# EAGLE design coil_havester_board (EAGLE 9.5.1)
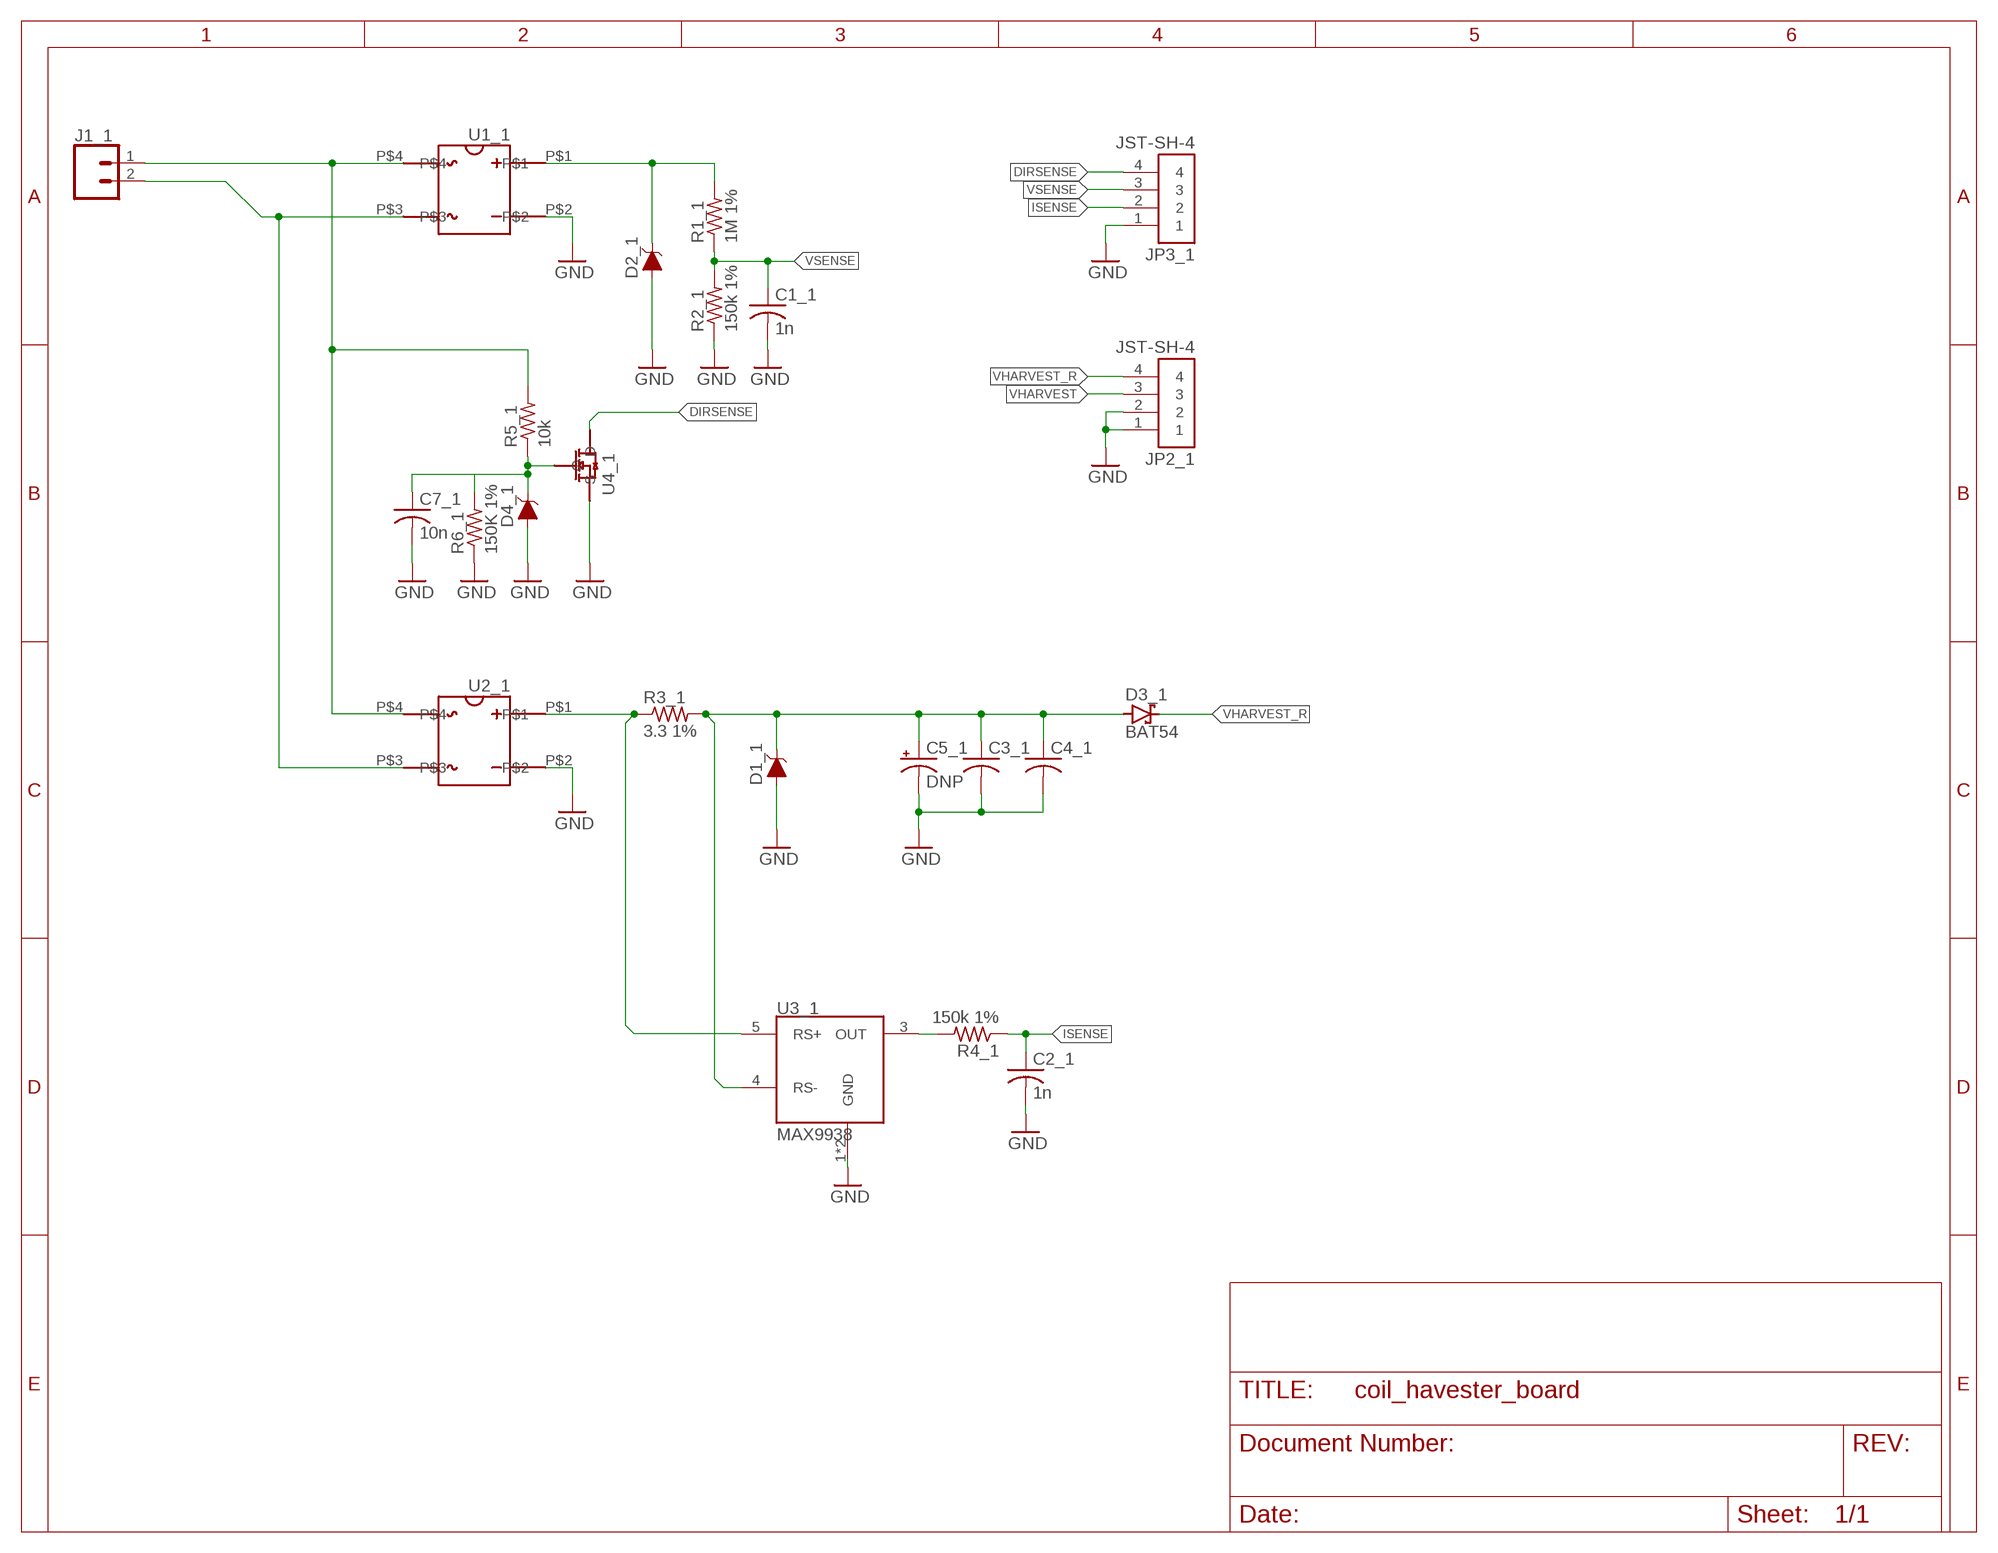
[diagram p0: schematic, sheet 1]

## Parts
C1_1  1n  C-USC0402  [C0402]
C2_1  1n  C-USC0402  [C0402]
C3_1  C-USC1206  [C1206]
C4_1  C-USC1206  [C1206]
C5_1  DNP  CPOL-USE2.5-5  [E2,5-5]
C7_1  10n  C-USC0402  [C0402]
D1_1  3.3V  DIODE-ZENER-MM3Z3V3T1G  [SOD-323]
D2_1  3.3V  DIODE-ZENER-MM3Z3V3T1G  [SOD-323]
D3_1  BAT54  [SOT23]
D4_1  3.3V  DIODE-ZENER-MM3Z3V3T1G  [SOD-323]
J1_1  CONN_02-JST-2MM-SMT  [JST-2-SMD]
JP2_1  JST-SH-4  [JST-SH-4]
JP3_1  JST-SH-4  [JST-SH-4]
R1_1  1M 1%  R-US_R0402  [R0402]
R2_1  150k 1%  R-US_R0402  [R0402]
R3_1  3.3 1%  R-US_R0603  [R0603]
R4_1  150k 1%  R-US_R0402  [R0402]
R5_1  10k  R-US_R0402  [R0402]
R6_1  150K 1%  R-US_R0402  [R0402]
U1_1  CDBHD140L-G  [CDBHDXX0L-G]
U2_1  CDBHD140L-G  [CDBHDXX0L-G]
U3_1  MAX9938  [SOT23-5]
U4_1  TN2106K1-G  [TN2106K1-G]

## Nets
DIRSENSE: JP3_1.4 U4_1.D
GND: C1_1.2 C2_1.2 C3_1.2 C4_1.2 C5_1.- C7_1.2 D1_1.A D2_1.A D4_1.A JP2_1.1 JP2_1.2 JP3_1.1 R2_1.1 R6_1.1 U1_1.P$2 U2_1.P$2 U3_1.1(GND) U3_1.2(GND) U4_1.S
ISENSE: C2_1.1 JP3_1.2 R4_1.1
N$1: J1_1.1 R5_1.2 U1_1.P$4 U2_1.P$4
N$2: J1_1.2 U1_1.P$3 U2_1.P$3
N$3: D2_1.C R1_1.2 U1_1.P$1
N$4: R3_1.1 U2_1.P$1 U3_1.5(RS+)
N$6: R4_1.2 U3_1.3(OUT)
N$7: C7_1.1 D4_1.C R5_1.1 R6_1.2 U4_1.G
VHARVEST: C3_1.1 C4_1.1 C5_1.+ D1_1.C D3_1.1(A) JP2_1.3 R3_1.2 U3_1.4(RS-)
VHARVEST_R: D3_1.3(C) JP2_1.4
VSENSE: C1_1.1 JP3_1.3 R1_1.1 R2_1.2

## Library data of the parts
C1_1 C2_1 = rcl:C-US: CAPACITOR, American symbol; MFR: SAMSUNG; MFR_PN: CL05B102KB5NNNC; SPICEPREFIX: C
C3_1 C4_1 = rcl:C-US: CAPACITOR, American symbol; MFR: TDK; MFR_PN: C3216X5R1E476M160AC; SPICEPREFIX: C
C5_1 = rcl:CPOL-US: POLARIZED CAPACITOR, American symbol; SPICEPREFIX: C
C7_1 = rcl:C-US: CAPACITOR, American symbol; MFR: SAMSUNG; MFR_PN: CL05B103KB5NNNC; SPICEPREFIX: C
D1_1 D2_1 = SparkFun-DiscreteSemi:DIODE-ZENER: Zener Diode A Zener diode allows current to flow from its anode to its cathode like a normal semiconductor diode, but it also permits current to flow in the reverse direction when its "Zener voltage" is reached. - WIkipedia; MFR: DIODES_INCORPORATED; MFR_PN: BZT52C15S; PROD_ID: DIO-11284
D3_1 = diode:BAT54: Schottky Diodes Source: Fairchild .. BAT54.pdf; MFR: ON; MFR_PN: BAT54
D4_1 = SparkFun-DiscreteSemi:DIODE-ZENER: Zener Diode A Zener diode allows current to flow from its anode to its cathode like a normal semiconductor diode, but it also permits current to flow in the reverse direction when its "Zener voltage" is reached. - WIkipedia; PROD_ID: DIO-11284
J1_1 = SparkFun-Connectors:CONN_02: Multi connection point. Often used as Generic Header-pin footprint for 0.1 inch spaced/style header connections On any of the 0.1 inch spaced packages, you can populate with these: Break Away Headers - Straight <https://www.sparkfun.com/products/116> (PRT-00116) Break Away Male Headers - Right Angle <https://www.sparkfun.com/products/553> (PRT-00553) Female Headers <https://www.sparkfun.com/products/115> (PRT-00115) Break Away Headers - Machine Pin <https://www.sparkfun.com/products/117> (PRT-00117) Break Away Female Headers - Swiss Machine Pin <https://www.sparkfun.com/products/743> (PRT-00743) For SCREWTERMINALS and SPRING TERMINALS visit here: Screw Terimnals on SparkFun.com <https://www.sparkfun.com/search/results?term=Screw+Terminals> (5mm/3.5mm/2.54mm spacing) This device is also useful as a general connection point to wire up your design to another part of your project. Our various solder wires solder well into these plated through hole pads. Hook-Up Wire - Assortment (Stranded, 22 AWG) <https://www.sparkfun.com/products/11375> (PRT-11375) Hook-Up Wire - Assortment (Solid Core, 22 AWG) <https://www.sparkfun.com/products/11367> (PRT-11367) View the entire wire category on our website here <https://www.sparkfun.com/categories/141> Special notes: Molex polarized connector foot print use with: PRT-08233 with associated crimp pins and housings. 2.54_SCREWTERM for use with PRT-10571. 3.5mm Screw Terminal footprints for PRT-08084 5mm Screw Terminal footprints for use with PRT-08432; MFR: JST; MFR_PN: S2B-PH-SM4-TB(LF)(SN); PROD_ID: CONN-11443
JP2_1 JP3_1 = jst-sh:JST-SH-4: JST-SH 4 pin connector; MFR: JST; MFR_PN: SM04B-SRSS-TB(LF)(SN)
R1_1 = rcl:R-US_: RESISTOR, American symbol; MFR: YAGEO; MFR_PN: RC0402FR-071ML; SPICEPREFIX: R
R2_1 R4_1 R6_1 = rcl:R-US_: RESISTOR, American symbol; MFR: YAGEO; MFR_PN: RC0402FR-07150KL; SPICEPREFIX: R
R3_1 = rcl:R-US_: RESISTOR, American symbol; MFR: PANASONIC; MFR_PN: ERJ-3BQF3R3V; SPICEPREFIX: R
R5_1 = rcl:R-US_: RESISTOR, American symbol; MFR: YAGEO; MFR_PN: RC0402FR-0710KL; SPICEPREFIX: R
U1_1 U2_1 = afig-0007:CDBHD140L-G; MFR: COMCHIP; MFR_PN: CDBHD140L-G
U3_1 = max9938:MAX9938: 1μA, 4-Bump UCSP/SOT23, Precision Current-Sense Amplifier The MAX9938 high-side current-sense amplifier offers precision accuracy specifications of VOS less than 500μV (max) and gain error less than 0.5% (max). Quiescent supply current is an ultra-low 1μA. The MAX9938 fits in a tiny, 1mm x 1mm UCSPTM package size or a 5-pin SOT23 package, making the part ideal for applications in notebook computers, cell phones, PDAs, and all battery-operated portable devices where accura- cy, low quiescent current, and small size are critical. The MAX9938 features an input common-mode voltage range from 1.6V to 28V. These current-sense amplifiers have a voltage output and are offered in four gain versions: 25V/V (MAX9938T), 50V/V (MAX9938F), 100V/V (MAX9938H), and 200V/V (MAX9938W). The four gain selections offer flexibility in the choice of the external current-sense resistor. The very low 500μV (max) input offset voltage allows small 25mV to 50mV full-scale VSENSE voltage for very low voltage drop at full-current measurement. The MAX9938 is offered in tiny 4-bump, UCSP (1mm x 1mm x 0.6mm footprint), 5-pin SOT23, and 6-pin μDFN (2mm x 2mm x 0.8mm) packages specified for operation over the -40°C to +85°C extended temperature range.; MFR: MAXIM; MFR_PN: MAX9938TEUK+T
U4_1 = tn2106:TN2106K1-G: N-Channel Enhancement-Mode Vertical DMOS FET R_dson(max) = 2.5Ohm V_gs(th)(max) = 2V; MFR: MICROCHIP; MFR_PN: TN2106K1-G

## Board
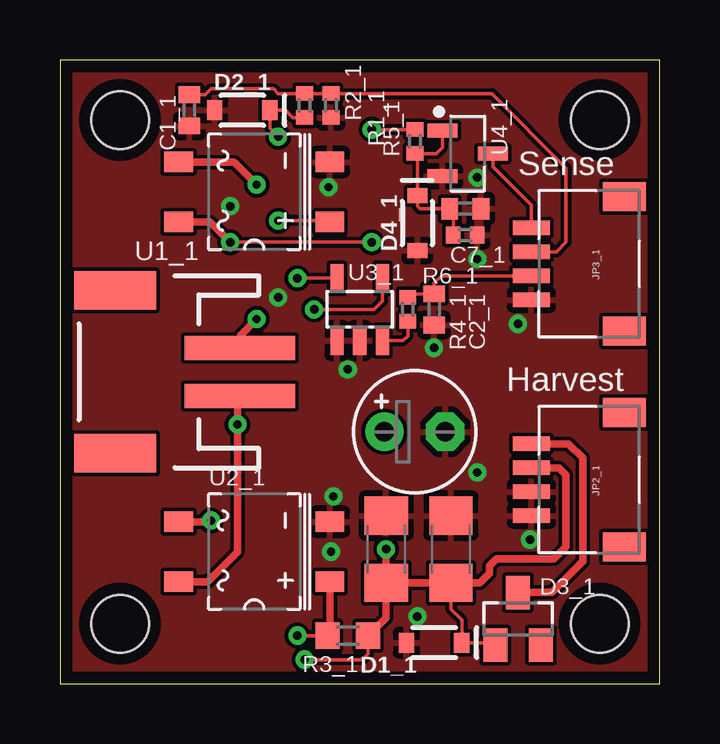
[diagram p1: board, top side]
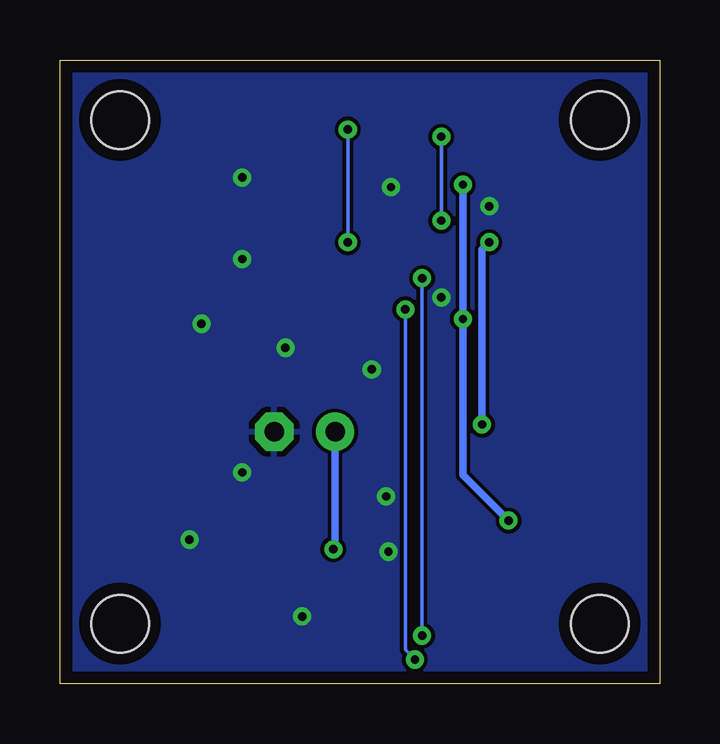
[diagram p2: board, bottom side, seen from below]

Size 25 x 26 mm. Coordinates in mm from the lower left corner, seen from the top.
Outline: 0,0 25,0 25,26 0,26 0,0
Copper layers (1*16): Top 0.035mm / dielectric 1.5mm / Bottom 0.035mm
Design rules "default *": minimum track width 6mil, minimum drill 0.35mm, track to track 6mil, track to pad 6mil, pad to pad 6mil, via to via 6mil, smd to smd 6mil, copper to edge 20mil, drill to drill 6mil, minimum pad ring 10mil, minimum via ring 8mil, stop-mask expansion 4mil, vias tented up to drill 0.35mm, thermal gap 10mil
Holes 2.4 mm at 2.5,23.5 2.5,2.5 22.5,2.5 22.5,23.5

### Footprints (pad centres in the part's own frame; a part is rotated, then mirrored left to right if it is on the bottom)
C0402 = smd 0.7 x 0.9: 1 -0.65,0; 2 0.65,0
C1206 = smd 1.6 x 1.8: 1 -1.4,0; 2 1.4,0
E2,5-5 = drill 0.813 pad 1.6: + -1.27,0 | drill 0.813 pad 1.6 octagon: - 1.27,0
SOD-323 = smd 0.63 x 0.83: A 1.15,0; C -1.15,0
SOT23 = smd 1 x 1.4: 1 -0.95,-1.1; 2 0.95,-1.1; 3 0,1.1
JST-2-SMD = smd 1 x 4.6: 1 -1,-3.7; 2 1,-3.7 | smd 1.6 x 3.4: NC1 -3.4,1.5; NC2 3.4,1.5
JST-SH-4 = smd 0.6 x 1.55: 1 -1.5,2.34; 2 -0.5,2.34; 3 0.5,2.34; 4 1.5,2.34 | smd 1.2 x 1.8: P-MOUNT1 -2.8,-1.535; P-MOUNT2 2.8,-1.535
R0402 = smd 0.6 x 0.7: 1 -0.5,0; 2 0.5,0
R0603 = smd 1 x 1.1: 1 -0.85,0; 2 0.85,0
CDBHDXX0L-G = smd 0.85 x 1.2: P$1 1.25,3.15; P$2 -1.25,3.15; P$3 -1.25,-3.15; P$4 1.25,-3.15
SOT23-5 = smd 0.55 x 1.2: 1 -0.95,-1.3; 2 0,-1.3; 3 0.95,-1.3; 4 0.95,1.3; 5 -0.95,1.3
TN2106K1-G = smd 1.24 x 0.589: D 1.056,0; G -1.056,0.95; S -1.056,-0.95

### Placement (x,y rotation side)
C1_1  5.4,23.9 270 top
C2_1  15.6,15.6 270 top
C3_1  13.6,5.6 90 top
C4_1  16.3,5.6 90 top
C5_1  14.8,10.5 0 top
C7_1  16.9,19.8 0 top
D1_1  15.6,1.7 180 top
D2_1  7.6,23.9 180 top
D3_1  19.1,2.7 0 top
D4_1  14.9,19.2 270 top
J1_1  3.8,13 90 top
JP2_1  22,8.5 90 top
JP3_1  22,17.5 90 top
R1_1  10.2,24.1 270 top
R2_1  11.3,24.1 90 top
R3_1  12,2 0 top
R4_1  14.5,15.6 270 top
R5_1  14.8,22.6 90 top
R6_1  16.9,18.7 180 top
U1_1  8.1,20.5 270 top
U2_1  8.1,5.5 270 top
U3_1  12.5,15.6 0 top
U4_1  17,22.1 0 top

### Tracks (layer width: path | path; a pad name or v marks a point on that pad's centre or on a via)
DIRSENSE
  Top 0.152: U4_1.D 18.06,21.54 19.66,19.94 JP3_1.4
GND  (via drill 0.35)
  other vias: 11.4,7.8 12,13.1 15.6,14 19.1,15 17.4,8.8 19.6,6 17.4,21.1 11.2,20.7 11.3,5.5 17.4,17.7 14.9,2.8 7.1,19.9 9.1,16.1
  pour Top: -1,27 26,27 26,-1 -1,-1
  pour Bottom: 26,27 -1,27 -1,-1 26,-1
ISENSE
  Top 0.152: R4_1.1 14.65,16.25 C2_1.1 15.6,16.7 15.9,17 JP3_1.2
N$1  (via drill 0.35)
  Top 0.152: R5_1.2 v13,23.1 | v7.1,18.4 v13,18.4
  Top 0.305: U2_1.P$4 6.15,4.25 7.4,5.5 v7.4,10.8 7.4,12 J1_1.1 | U1_1.P$4 6.25,19.25 v7.1,18.4
  Bottom 0.152: v13,18.4 v13,23.1
  Bottom 0.305: v7.1,18.4 7.4,18.1 v7.4,10.8
N$2  (via drill 0.35)
  Top 0.305: U1_1.P$3 7.25,21.75 v8.2,20.8 | U2_1.P$3 6.25,6.75 v6.3,6.8 | J1_1.2 7.5,14.5 v8.2,15.2
  Bottom 0.305: v6.3,6.8 8.2,8.7 v8.2,15.2 v8.2,20.8
N$3  (via drill 0.35)
  Top 0.152: U1_1.P$1 11.2,19.3 v9.1,19.3 | v9.1,22.8 8.75,23.15 D2_1.C 9.4,23.9 9.7,23.6 R1_1.2
  Bottom 0.152: v9.1,22.8 v9.1,19.3
N$4  (via drill 0.35)
  Top 0.152: R3_1.1 v9.9,2 | v9.9,16.9 U3_1.5
  Top 0.305: U2_1.P$1 11.25,2.1 R3_1.1
  Bottom 0.152: v9.9,2 v9.9,16.9
N$6
  Top 0.152: U3_1.3 14.3,14.3 14.5,14.5 R4_1.2
N$7
  Top 0.152: U4_1.G 15.94,22.34 15.7,22.1 R5_1.1 14.9,22 D4_1.C 14.9,19.9 15,19.8 C7_1.1 16.4,19.65 R6_1.2
VHARVEST  (via drill 0.35)
  Top 0.152: R3_1.2 12.85,1.24 12.61,1 v10.2,1 | v10.6,15.6 13.1,15.6 13.45,15.95 U3_1.4 | C4_1.1 16.3,3.1 16.75,2.65 D1_1.C 18.05,1.7 D3_1.1
  Top 0.305: C3_1.1 13.6,2.75 R3_1.2 | C3_1.1 C4_1.1 | 16.35,4.25 C4_1.1 | C3_1.1 v13.6,5.6 | JP2_1.3 20.8,9 21.1,8.7 21.1,5.7 20.6,5.2 18.2,5.2 17.9,4.9 17.9,4.6 17.5,4.2 C4_1.1
  Bottom 0.152: v10.2,1 10.6,1.4 v10.6,15.6
  Bottom 0.305: v13.6,5.6 13.53,5.67 C5_1.+
VHARVEST_R
  Top 0.305: D3_1.3 20.5,3.8 21.8,5.1 21.8,9.4 21.2,10 JP2_1.4
VSENSE
  Top 0.152: 5.45,24.6 C1_1.1 6.05,24.55 6.3,24.8 8.9,24.8 9.1,24.6 R1_1.1 R2_1.2 18,24.6 21.1,21.5 21.1,18.4 20.7,18 JP3_1.3

### Text on the board
tPlace: Sense | Harvest